# EAGLE design voltage-divider (EAGLE 6.5.0)
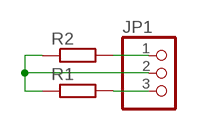
[diagram p0: schematic, sheet 1]

## Parts
JP1  PINHD-1X3  [1X03]
R1  R-EU_R0805  [R0805]
R2  R-EU_R0805  [R0805]

## Nets
N$1: JP1.1 R2.2
N$2: JP1.3 R1.2
N$3: JP1.2 R1.1 R2.1

## Library data of the parts
JP1 = pinhead:PINHD-1X3: PIN HEADER
R1 R2 = p.peter-rcl:R-EU_: RESISTOR, European symbol

## Board
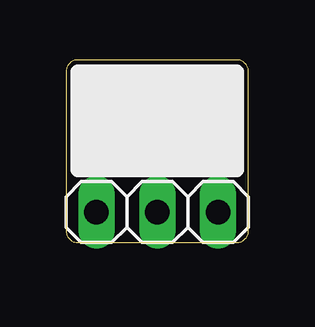
[diagram p1: board, top side]
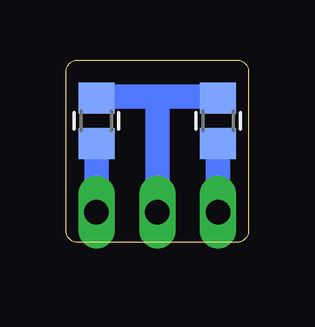
[diagram p2: board, bottom side, seen from below]

Size 7.62 x 7.62 mm. Coordinates in mm from the lower left corner, seen from the top.
Outline: 0,0.51 arc90 0.51,0 7.11,0 arc90 7.62,0.51 7.62,7.11 arc90 7.11,7.62 0.51,7.62 arc90 0,7.11 0,0.51
Copper layers (1*16): Top 0.0356mm / dielectric 1.5011mm / Bottom 0.0356mm
Design rules "oshpark": minimum track width 6mil, minimum drill 13mil, track to track 6mil, track to pad 6mil, pad to pad 6mil, via to via 6mil, smd to smd 6mil, copper to edge 15mil, drill to drill 6mil, minimum pad ring 7mil, minimum via ring 7mil, stop-mask expansion 4mil, vias tented up to drill 4.1mm, thermal gap 10mil

### Footprints (pad centres in the part's own frame; a part is rotated, then mirrored left to right if it is on the bottom)
1X03 = drill 1.016 long: 1 -2.54,0; 2 0,0; 3 2.54,0
R0805 = smd 1.3 x 1.5: 1 -0.95,0; 2 0.95,0

### Placement (x,y rotation side)
JP1  3.81,1.27 0 top
R1  6.35,5.08 270 bottom
R2  1.27,5.08 270 bottom

### Tracks (layer width: path | path; a pad name or v marks a point on that pad's centre or on a via)
N$1
  Bottom 1.016: JP1.1 R2.2
N$2
  Bottom 1.016: JP1.3 R1.2
N$3
  Bottom 1.016: R2.1 1.27,6.1 3.81,6.1 | 3.81,6.1 6.35,6.1 R1.1 | JP1.2 3.81,6.1